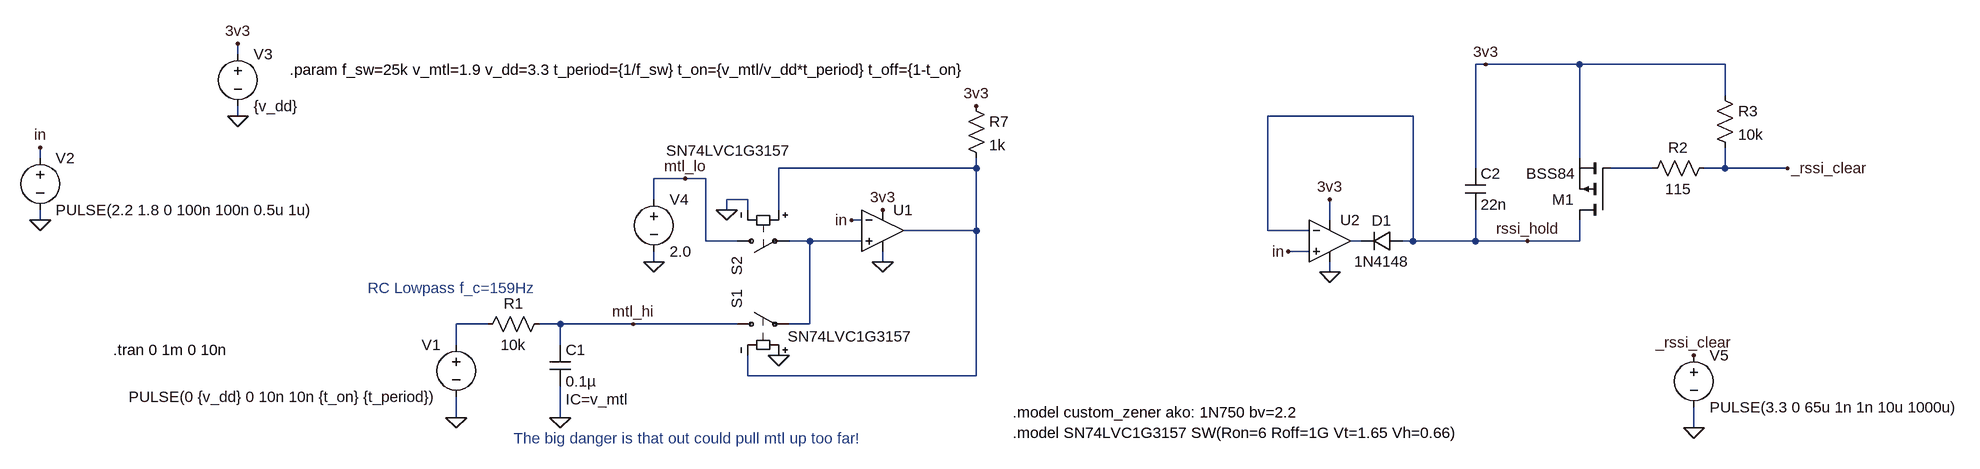
[diagram p0: schematic hysteresis_comparator.asc]
hysteresis_comparator.asc, the LTspice schematic file:
Version 4
SHEET 1 2180 680
WIRE -496 -176 -496 -192
WIRE 1424 -160 1408 -160
WIRE 1568 -160 1424 -160
WIRE 1792 -160 1568 -160
WIRE 1792 -112 1792 -160
WIRE -496 -80 -496 -96
WIRE 1312 -80 1088 -80
WIRE -800 -16 -800 -32
WIRE 1568 -16 1568 -160
WIRE 640 0 640 -16
WIRE 640 0 336 0
WIRE 1408 0 1408 -160
WIRE 1680 0 1616 0
WIRE 1792 0 1792 -32
WIRE 1792 0 1760 0
WIRE 1888 0 1792 0
WIRE 192 16 144 16
WIRE 224 16 192 16
WIRE 144 48 144 16
WIRE 288 48 256 48
WIRE 256 64 256 48
WIRE 288 64 288 48
WIRE 336 64 336 0
WIRE -800 80 -800 64
WIRE 464 80 448 80
WIRE 1184 80 1184 48
WIRE 640 96 640 0
WIRE 640 96 528 96
WIRE 1088 96 1088 -80
WIRE 1152 96 1088 96
WIRE 224 112 224 16
WIRE 272 112 224 112
WIRE 384 112 352 112
WIRE 464 112 384 112
WIRE 1232 112 1216 112
WIRE 1312 112 1312 -80
WIRE 1312 112 1296 112
WIRE 1408 112 1408 64
WIRE 1408 112 1312 112
WIRE 1488 112 1408 112
WIRE 1568 112 1568 80
WIRE 1568 112 1488 112
WIRE 1152 128 1120 128
WIRE 144 144 144 128
WIRE 496 144 496 128
WIRE 1184 160 1184 144
WIRE -112 240 -160 240
WIRE 0 240 -32 240
WIRE 112 240 0 240
WIRE 272 240 112 240
WIRE 384 240 384 112
WIRE 384 240 352 240
WIRE -160 272 -160 240
WIRE 0 272 0 240
WIRE 288 320 288 288
WIRE 640 320 640 96
WIRE 640 320 288 320
WIRE -160 384 -160 352
WIRE 0 384 0 336
WIRE 1744 400 1744 368
FLAG 0 384 0
FLAG 496 144 0
FLAG -160 384 0
FLAG -800 -32 in
FLAG 448 80 in
FLAG -800 80 0
FLAG -496 -192 3v3
FLAG -496 -80 0
FLAG 112 240 mtl_hi
FLAG 640 -96 3v3
FLAG 496 64 3v3
FLAG 336 288 0
FLAG 144 144 0
FLAG 256 64 0
FLAG 192 16 mtl_lo
FLAG 1120 128 in
FLAG 1184 48 3v3
FLAG 1184 160 0
FLAG 1424 -160 3v3
FLAG 1888 0 _rssi_clear
FLAG 1488 112 rssi_hold
FLAG 1744 400 0
FLAG 1744 288 _rssi_clear
SYMBOL voltage -160 256 M0
WINDOW 123 0 0 Left 0
WINDOW 39 0 0 Left 0
SYMATTR InstName V1
SYMATTR Value PULSE(0 {v_dd} 0 10n 10n {t_on} {t_period})
SYMBOL res -16 224 R90
WINDOW 0 0 56 VBottom 2
WINDOW 3 32 56 VTop 2
SYMATTR InstName R1
SYMATTR Value 10k
SYMBOL cap -16 272 R0
WINDOW 39 24 84 Left 2
SYMATTR SpiceLine IC=v_mtl
SYMATTR InstName C1
SYMATTR Value 0.1µ
SYMBOL voltage -800 -32 R0
WINDOW 123 0 0 Left 0
WINDOW 39 0 0 Left 0
SYMATTR InstName V2
SYMATTR Value PULSE(2.2 1.8 0 100n 100n 0.5u 1u)
SYMBOL voltage -496 -192 R0
WINDOW 123 0 0 Left 0
WINDOW 39 0 0 Left 0
SYMATTR InstName V3
SYMATTR Value {v_dd}
SYMBOL OpAmps\\UniversalOpAmp2 496 96 R0
SYMATTR InstName U1
SYMATTR Value2 Avol=1Meg GBW=10G Slew=10G
SYMBOL res 624 -112 R0
SYMATTR InstName R7
SYMATTR Value 1k
SYMBOL sw 256 240 R270
WINDOW 3 -19 94 VRight 2
SYMATTR Value SN74LVC1G3157
SYMATTR InstName S1
SYMBOL sw 256 112 M90
WINDOW 3 -139 100 VLeft 2
SYMATTR Value SN74LVC1G3157
SYMATTR InstName S2
SYMBOL voltage 144 32 R0
SYMATTR InstName V4
SYMATTR Value 2.0
SYMBOL OpAmps\\UniversalOpAmp2 1184 112 R0
SYMATTR InstName U2
SYMATTR Value2 Avol=1Meg GBW=10G Slew=10G
SYMBOL diode 1296 96 R90
WINDOW 0 0 32 VBottom 2
WINDOW 3 32 32 VTop 2
SYMATTR InstName D1
SYMATTR Value 1N4148
SYMBOL pmos 1616 80 R180
SYMATTR InstName M1
SYMATTR Value BSS84
SYMBOL cap 1392 0 R0
SYMATTR InstName C2
SYMATTR Value 22n
SYMBOL res 1776 -16 R90
WINDOW 0 0 56 VBottom 2
WINDOW 3 32 56 VTop 2
SYMATTR InstName R2
SYMATTR Value 115
SYMBOL res 1776 -128 R0
SYMATTR InstName R3
SYMATTR Value 10k
SYMBOL voltage 1744 272 R0
WINDOW 123 0 0 Left 0
WINDOW 39 0 0 Left 0
SYMATTR InstName V5
SYMATTR Value PULSE(3.3 0 65u 1n 1n 10u 1000u)
TEXT -296 184 Left 2 ;RC Lowpass f_c=159Hz
TEXT -416 -152 Left 2 !.param f_sw=25k v_mtl=1.9 v_dd=3.3 t_period={1/f_sw} t_on={v_mtl/v_dd*t_period} t_off={1-t_on}
TEXT -688 280 Left 2 !.tran 0 1m 0 10n
TEXT -72 416 Left 2 ;The big danger is that out could pull mtl up too far!
TEXT 696 376 Left 2 !.model custom_zener ako: 1N750 bv=2.2\n.model SN74LVC1G3157 SW(Ron=6 Roff=1G Vt=1.65 Vh=0.66)

The netlist it stands for:
* hysteresis_comparator.asc
V1 N005 0 PULSE(0 {v_dd} 0 10n 10n {t_on} {t_period})
R1 mtl_hi N005 10k
C1 mtl_hi 0 0.1µ IC=v_mtl
V2 in 0 PULSE(2.2 1.8 0 100n 100n 0.5u 1u)
V3 3v3 0 {v_dd}
XU1 N003 in 3v3 0 N001 level2 Avol=1Meg GBW=10G Slew=10G Ilimit=25m Rail=0 Vos=0 En=0 Enk=0 In=0 Ink=0 Rin=500Meg  ; pins In+ In- V+ V- OUT
R7 3v3 N001 1k
S1 mtl_hi N003 0 N001 SN74LVC1G3157
S2 mtl_lo N003 N001 0 SN74LVC1G3157
V4 mtl_lo 0 2.0
XU2 in rssi_hold 3v3 0 N004 level2 Avol=1Meg GBW=10G Slew=10G Ilimit=25m Rail=0 Vos=0 En=0 Enk=0 In=0 Ink=0 Rin=500Meg  ; pins In+ In- V+ V- OUT
D1 rssi_hold N004 1N4148
M1 rssi_hold N002 3v3 3v3 BSS84
C2 3v3 rssi_hold 22n
R2 _rssi_clear N002 115
R3 3v3 _rssi_clear 10k
V5 _rssi_clear 0 PULSE(3.3 0 65u 1n 1n 10u 1000u)
.model D D
.lib standard.dio
.model NMOS NMOS
.model PMOS PMOS
.lib standard.mos
* RC Lowpass f_c=159Hz
.param f_sw=25k v_mtl=1.9 v_dd=3.3 t_period={1/f_sw} t_on={v_mtl/v_dd*t_period} t_off={1-t_on}
.tran 0 1m 0 10n
* The big danger is that out could pull mtl up too far!
.model custom_zener ako: 1N750 bv=2.2
.model SN74LVC1G3157 SW(Ron=6 Roff=1G Vt=1.65 Vh=0.66)
.lib UniversalOpAmp2.lib
.backanno
.end